# Altium schematic sheet CH32H417WEU6-R0.SchDoc
size 457 x 287 mm; SheetNumber: 1; SheetTotal: 1
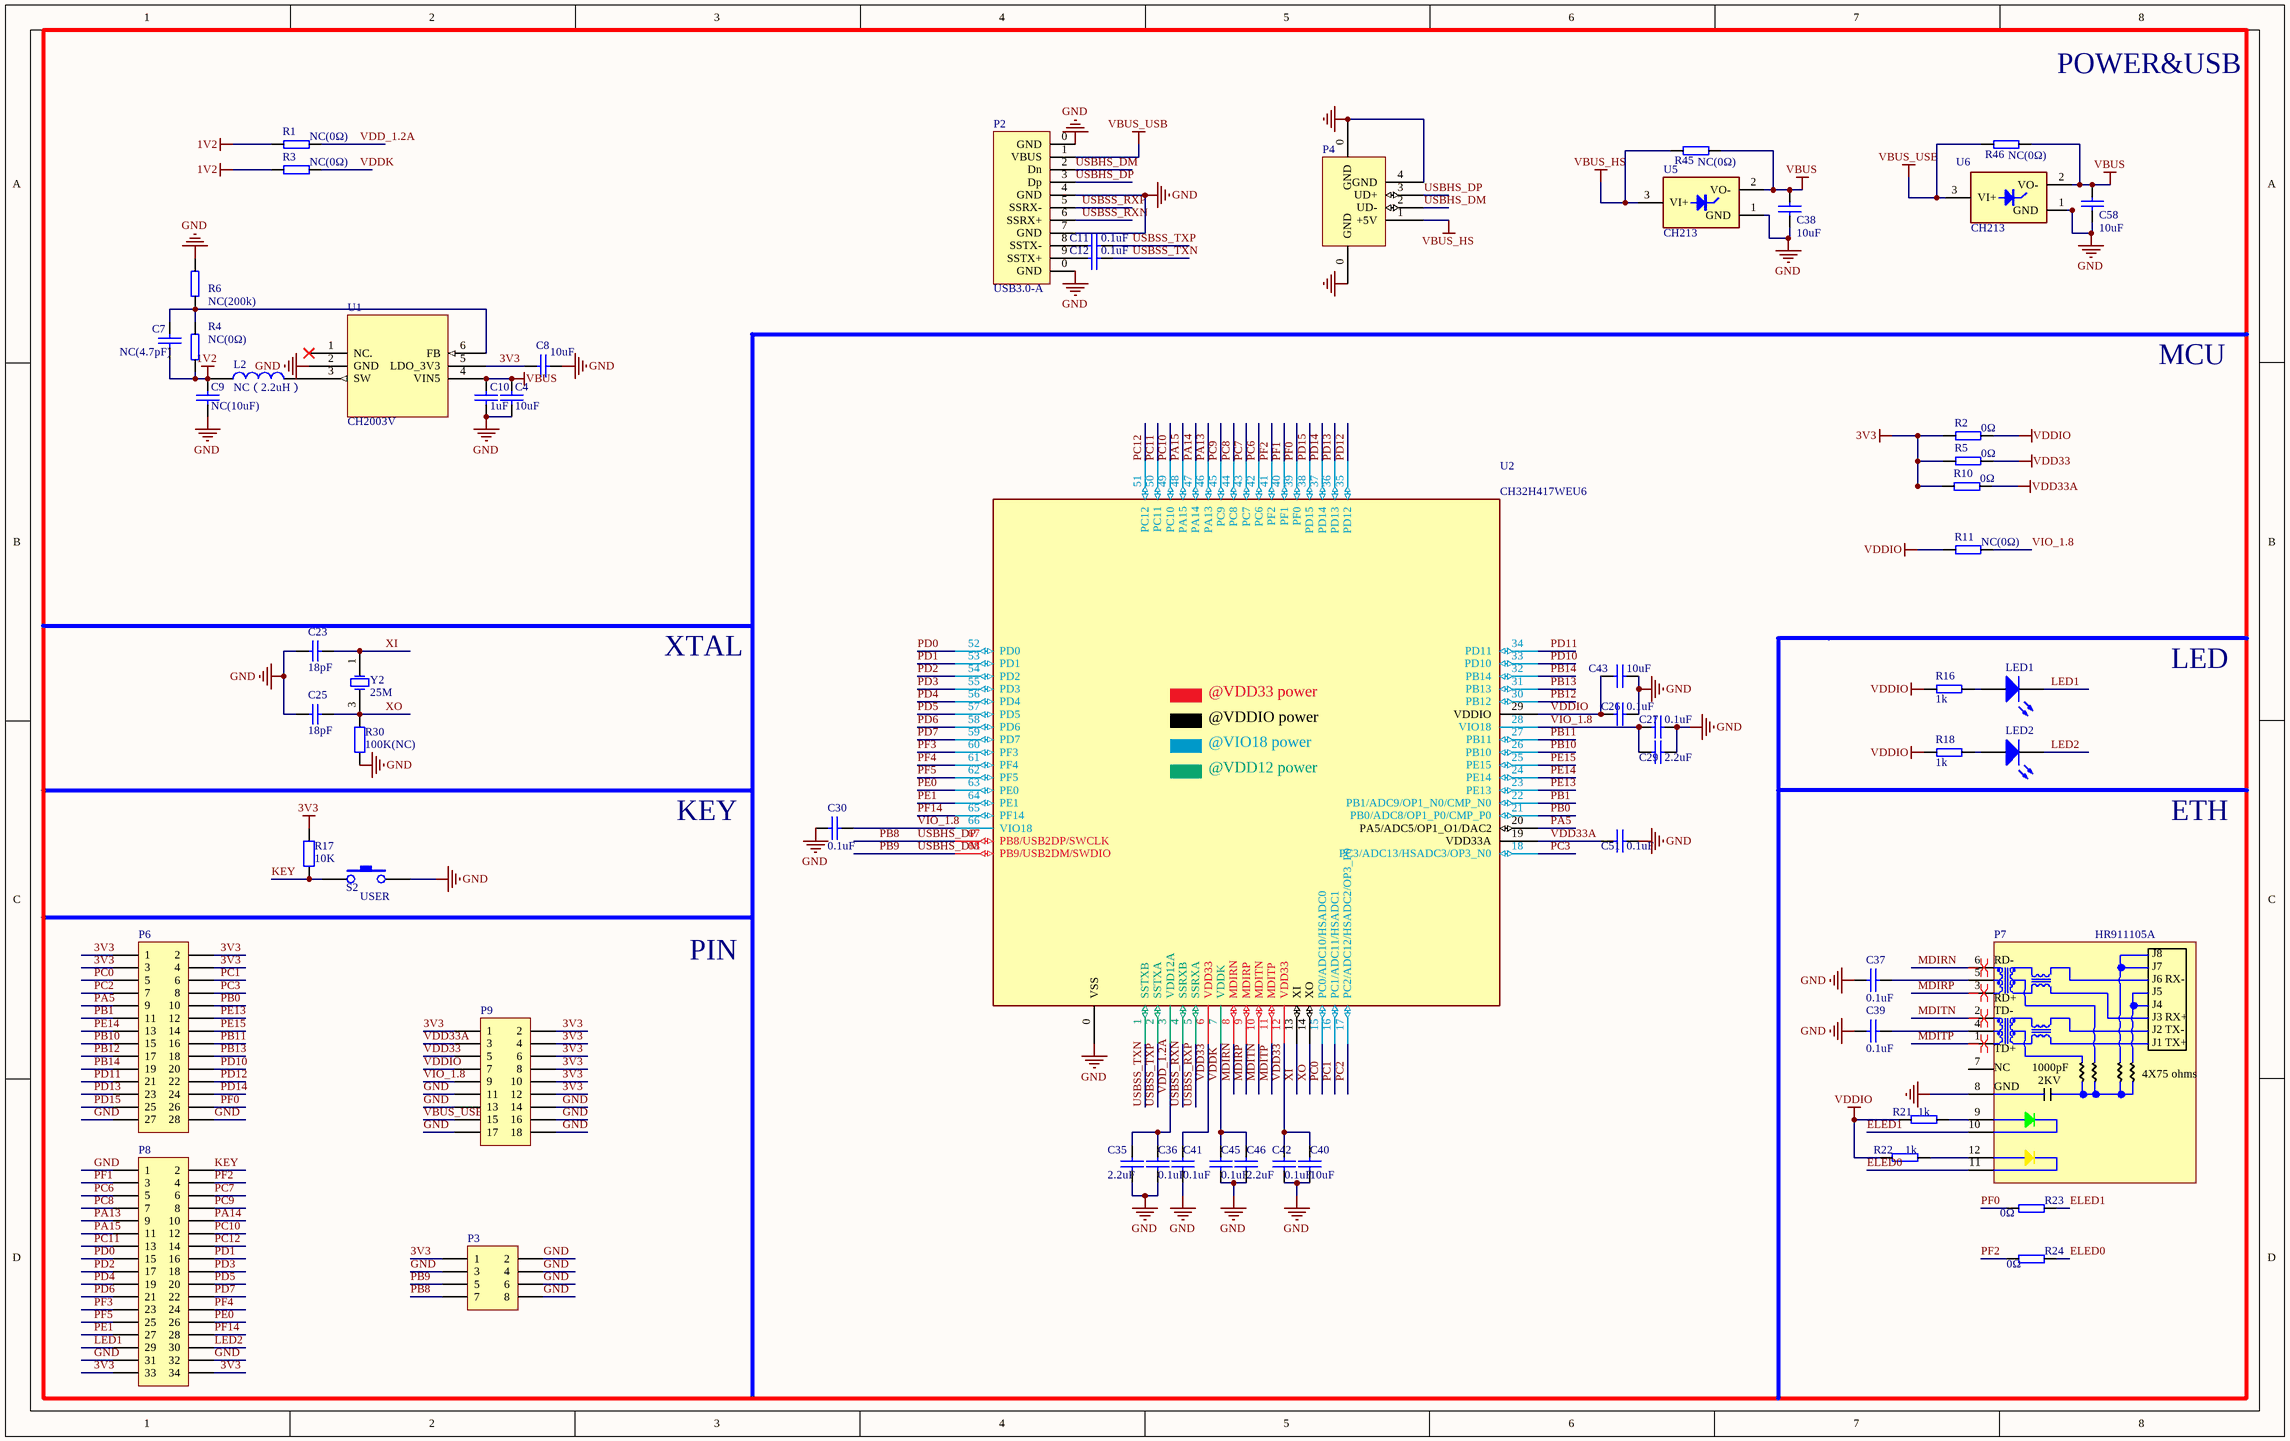
[diagram p0: CH32H417WEU6-R0.SchDoc]

## Parts
C4  10uF  [0603_C]
C7  NC(4.7pF)  [0402_C]
C8  10uF  [0603_C]
C9  NC(10uF)  [0603_C]
C10  1uF  [0402_C]
C11  0.1uF  [0402_C]
C12  0.1uF  [0402_C]
C23  18pF  [0402_C]
C25  18pF  [0402_C]
C26  0.1uF  [0402_C]
C27  0.1uF  [0402_C]
C29  2.2uF  [0402_C]
C30  0.1uF  [0402_C]
C35  2.2uF  [0402_C]
C36  0.1uF  [0402_C]
C37  0.1uF  [0402_C]
C38  10uF  [0603_C]
C39  0.1uF  [0402_C]
C40  10uF  [0402_C]
C41  0.1uF  [0402_C]
C42  0.1uF  [0402_C]
C43  10uF  [0402_C]
C45  0.1uF  [0402_C]
C46  2.2uF  [0402_C]
C51  0.1uF  [0402_C]
C58  10uF  [0603_C]
L2  NC（2.2uH）  [CD32]
LED1  LED2  blue  [0603+]  (value not drawn)
LED2  LED1   blue  [0603+]  (value not drawn)
P2  USB3.0-A  [USB3.0-A-Receptacle]
P3  HEADER 4x2  [IDC8-2.54mm]  (value not drawn)
P4  USB_A  [USBAF]  (value not drawn)
P6  HEADER 14x2  [IDC28-2.54MM]  (value not drawn)
P7  HR911105A  [HR911105A]
P8  HEADER 17x2  [IDC34-2.54MM]  (value not drawn)
P9  HEADER 9x2  [IDC18-2.54MM]  (value not drawn)
R1  NC(0Ω)  [0402]
R2  0Ω  [0402]
R3  NC(0Ω)  [0402]
R4  NC(0Ω)  [0402]
R5  0Ω  [0402]
R6  NC(200k)  [0402]
R10  0Ω  [0402]
R11  NC(0Ω)  [0402]
R16  1k  [0402]
R17  10K  [0402]
R18  1k  [0402]
R21  1k  [0402]
R22  1k  [0402]
R23  0Ω  [0402]
R24  0Ω  [0402]
R30  100K(NC)  [0402]
R45  NC(0Ω)  [0402]
R46  NC(0Ω)  [0402]
S2  USER  [SMD_6.1x3.65x2.5mm-KEY]
U1  CH2003V  [SOT-23-6]
U2  CH32H417WEU6  [QFN68_8X8]
U5  CH213  [SOT-23-3]
U6  CH213  [SOT-23-3]
Y2  25M  [XT3225]

## Nets
1V2: C7.1 C9.2 L2.2 R1.2 R3.2 R4.1
3V3: C8.2 P3.1 P6.1 P6.2 P6.3 P6.4 P8.33 P8.34 P9.1 P9.2 P9.4 P9.6 P9.8 P9.10 P9.12 R2.2 R5.2 R10.2 R17.1 U1.5(LDO_3V3)
GND: C4.1 C8.1 C9.1 C10.1 C23.1 C25.1 C26.2 C27.2 C29.1 C30.2 C35.1 C36.1 C37.1 C38.2 C39.1 C40.1 C41.1 C42.1 C43.1 C45.1 C46.2 C51.1 C58.2 P2.0(GND) P2.4(GND) P2.7(GND) P3.2 P3.3 P3.4 P3.6 P3.8 P4.0(GND) P4.4(GND) P6.27 P6.28 P7.8 P8.1 P8.31 P8.32 P9.11 P9.13 P9.14 P9.16 P9.17 P9.18 R6.2 R30.1 S2.2 U1.2(GND) U2.0(VSS) U5.1(GND) U6.1(GND)
VBUS: C4.2 C10.2 C38.1 C58.1 R45.1 R46.1 U1.4(VIN5) U5.2(VO-) U6.2(VO-)
VBUS_HS: P4.1(+5V) R45.2 U5.3(VI+)
VBUS_USB: P2.1(VBUS) P9.15 R46.2 U6.3(VI+)
VDD33: C40.2 C41.2 C42.2 P9.5 R5.1 U2.6(VDD33) U2.12(VDD33)
VDD33A: C51.2 P9.3 R10.1 U2.19(VDD33A)
VDDIO: C26.1 C43.2 P9.7 R2.1 R11.2 R16.1 R18.1 R21.1 R22.1 U2.29(VDDIO)
ELED0: P7.11 R24.2
ELED1: P7.10 R23.2
KEY: P8.2 R17.2 S2.1
LED1: LED1.2(K) P8.29
LED2: LED2.2(K) P8.30
MDIRN: P7.6 U2.8(MDIRN)
MDIRP: P7.3 U2.9(MDIRP)
MDITN: P7.2 U2.10(MDITN)
MDITP: P7.1 U2.11(MDITP)
PA5: P6.9 U2.20(PA5/ADC5/OP1_O1/DAC2)
PA13: P8.9 U2.46(PA13)
PA14: P8.10 U2.47(PA14)
PA15: P8.11 U2.48(PA15)
PB0: P6.10 U2.21(PB0/ADC8/OP1_P0/CMP_P0)
PB1: P6.11 U2.22(PB1/ADC9/OP1_N0/CMP_N0)
PB8: P2.3(Dp) P3.7 P4.3(UD+) U2.67(PB8/USB2DP/SWCLK)  [also labelled USBHS_DP]
PB9: P2.2(Dn) P3.5 P4.2(UD-) U2.68(PB9/USB2DM/SWDIO)  [also labelled USBHS_DM]
PB10: P6.15 U2.26(PB10)
PB11: P6.16 U2.27(PB11)
PB12: P6.17 U2.30(PB12)
PB13: P6.18 U2.31(PB13)
PB14: P6.19 U2.32(PB14)
PC0: P6.5 U2.15(PC0/ADC10/HSADC0)
PC1: P6.6 U2.16(PC1/ADC11/HSADC1)
PC2: P6.7 U2.17(PC2/ADC12/HSADC2/OP3_P0)
PC3: P6.8 U2.18(PC3/ADC13/HSADC3/OP3_N0)
PC6: P8.5 U2.42(PC6)
PC7: P8.6 U2.43(PC7)
PC8: P8.7 U2.44(PC8)
PC9: P8.8 U2.45(PC9)
PC10: P8.12 U2.49(PC10)
PC11: P8.13 U2.50(PC11)
PC12: P8.14 U2.51(PC12)
PD0: P8.15 U2.52(PD0)
PD1: P8.16 U2.53(PD1)
PD2: P8.17 U2.54(PD2)
PD3: P8.18 U2.55(PD3)
PD4: P8.19 U2.56(PD4)
PD5: P8.20 U2.57(PD5)
PD6: P8.21 U2.58(PD6)
PD7: P8.22 U2.59(PD7)
PD10: P6.20 U2.33(PD10)
PD11: P6.21 U2.34(PD11)
PD12: P6.22 U2.35(PD12)
PD13: P6.23 U2.36(PD13)
PD14: P6.24 U2.37(PD14)
PD15: P6.25 U2.38(PD15)
PE0: P8.26 U2.63(PE0)
PE1: P8.27 U2.64(PE1)
PE13: P6.12 U2.23(PE13)
PE14: P6.13 U2.24(PE14)
PE15: P6.14 U2.25(PE15)
PF0: P6.26 R23.1 U2.39(PF0)
PF1: P8.3 U2.40(PF1)
PF2: P8.4 R24.1 U2.41(PF2)
PF3: P8.23 U2.60(PF3)
PF4: P8.24 U2.61(PF4)
PF5: P8.25 U2.62(PF5)
PF14: P8.28 U2.65(PF14)
USBSS_RXN: P2.6(SSRX+) U2.4(SSRXB)
USBSS_RXP: P2.5(SSRX-) U2.5(SSRXA)
USBSS_TXN: C12.2 U2.1(SSTXB)
USBSS_TXP: C11.2 U2.2(SSTXA)
VDD_1.2A: C35.2 C36.2 R1.1 U2.3(VDD12A)
VDDK: C45.2 C46.1 R3.1 U2.7(VDDK)
VIO_1.8: C27.1 C29.2 C30.1 P9.9 R11.1 U2.28(VIO18) U2.66(VIO18)
XI: C23.2 U2.13(XI) Y2.1(OSC1)
XO: C25.2 R30.2 U2.14(XO) Y2.3(OSC2)
NetC7_2: C7.2 R4.2 R6.1 U1.6(FB)
NetC11_1: C11.1 P2.8(SSTX-)
NetC12_1: C12.1 P2.9(SSTX+)
NetC37_2: C37.2 P7.5
NetC39_2: C39.2 P7.4
NetL2_1: L2.1 U1.3(SW)
NetLED1_1: LED1.1(A) R16.2
NetLED2_1: LED2.1(A) R18.2
NetP7_9: P7.9 R21.2
NetP7_12: P7.12 R22.2

Not connected (* = marked no-connect by the designer): P7 7; U1 1(NC.)*

## Layout directives
differential pair: MDIRN, MDIRP, MDITN, MDITP

## Notes on the sheet
- POWER&USB
- MCU
- XTAL
- LED
- KEY
- ETH
- PIN
- Title
- Size:
- Date:
- A3
- Number:
- Time:
- Revision:
- Sheet
- of
- File:
- (in symbol CH32H417WEU6) @VDD33 power; @VDDIO power; @VIO18 power; @VDD12 power
- (in symbol HR911105A) J8; RD-; J7; J6; RX-; J5; RD+; J4; TD-; J3; RX+; J2; TX-; J1; TX+; TD+; NC; 1000pF; 4X75 ohms; 2KV; GND

## Library data of the parts
C4 C7-C12 C26 C27 C29 C30 C35-C43 C45 C46 C51 C58 = CAP: Capacitor
C23 C25 = Cap: Capacitor
L2 = INDUCTOR
LED1 LED2 = LED0: Typical INFRARED GaAs LED; Published: 8-Jun-2000; LatestRevisionDate: 08-Jul-2005; LatestRevisionNote: Mech Layer 1 removed.; PackageReference: LED-0; Publisher: Altium Limited
P3 = HEADER 4x2: Header, 4-Pin, Dual row
P4 = USB: USB Port
P6 = HEADER 14x2: Header, 14-Pin, Dual row
P8 = HEADER 17x2: Header, 17-Pin, Dual row
P9 = HEADER 9x2: Header, 9-Pin, Dual row
R1-R6 R10 R11 R16 R18 R21-R24 R45 R46 = RES
R17 R30 = Res2: Resistor
S2 = KEY1
U1 = CH2003K: Step-Down DC-DC Converter, 5V input, FB 0.6V, 800mA output, with LDO 3.3V * 200mA
U2 = CH32H417WEU6: RISC-V FPU HD-MCU, 400MHz, USB3.0, 100M Ethernet, DVP, SDMMC, QSPI, OPA, ADC, DAC
U5 U6 = CH213E: Ideal Diode 5V*1A
Y2 = XTAL: Crystal Oscillator; Published: 8-Jun-2000; LatestRevisionDate: 17-Jul-2002; LatestRevisionNote: Re-released for DXP Platform.; PackageReference: R38; Publisher: Altium Limited